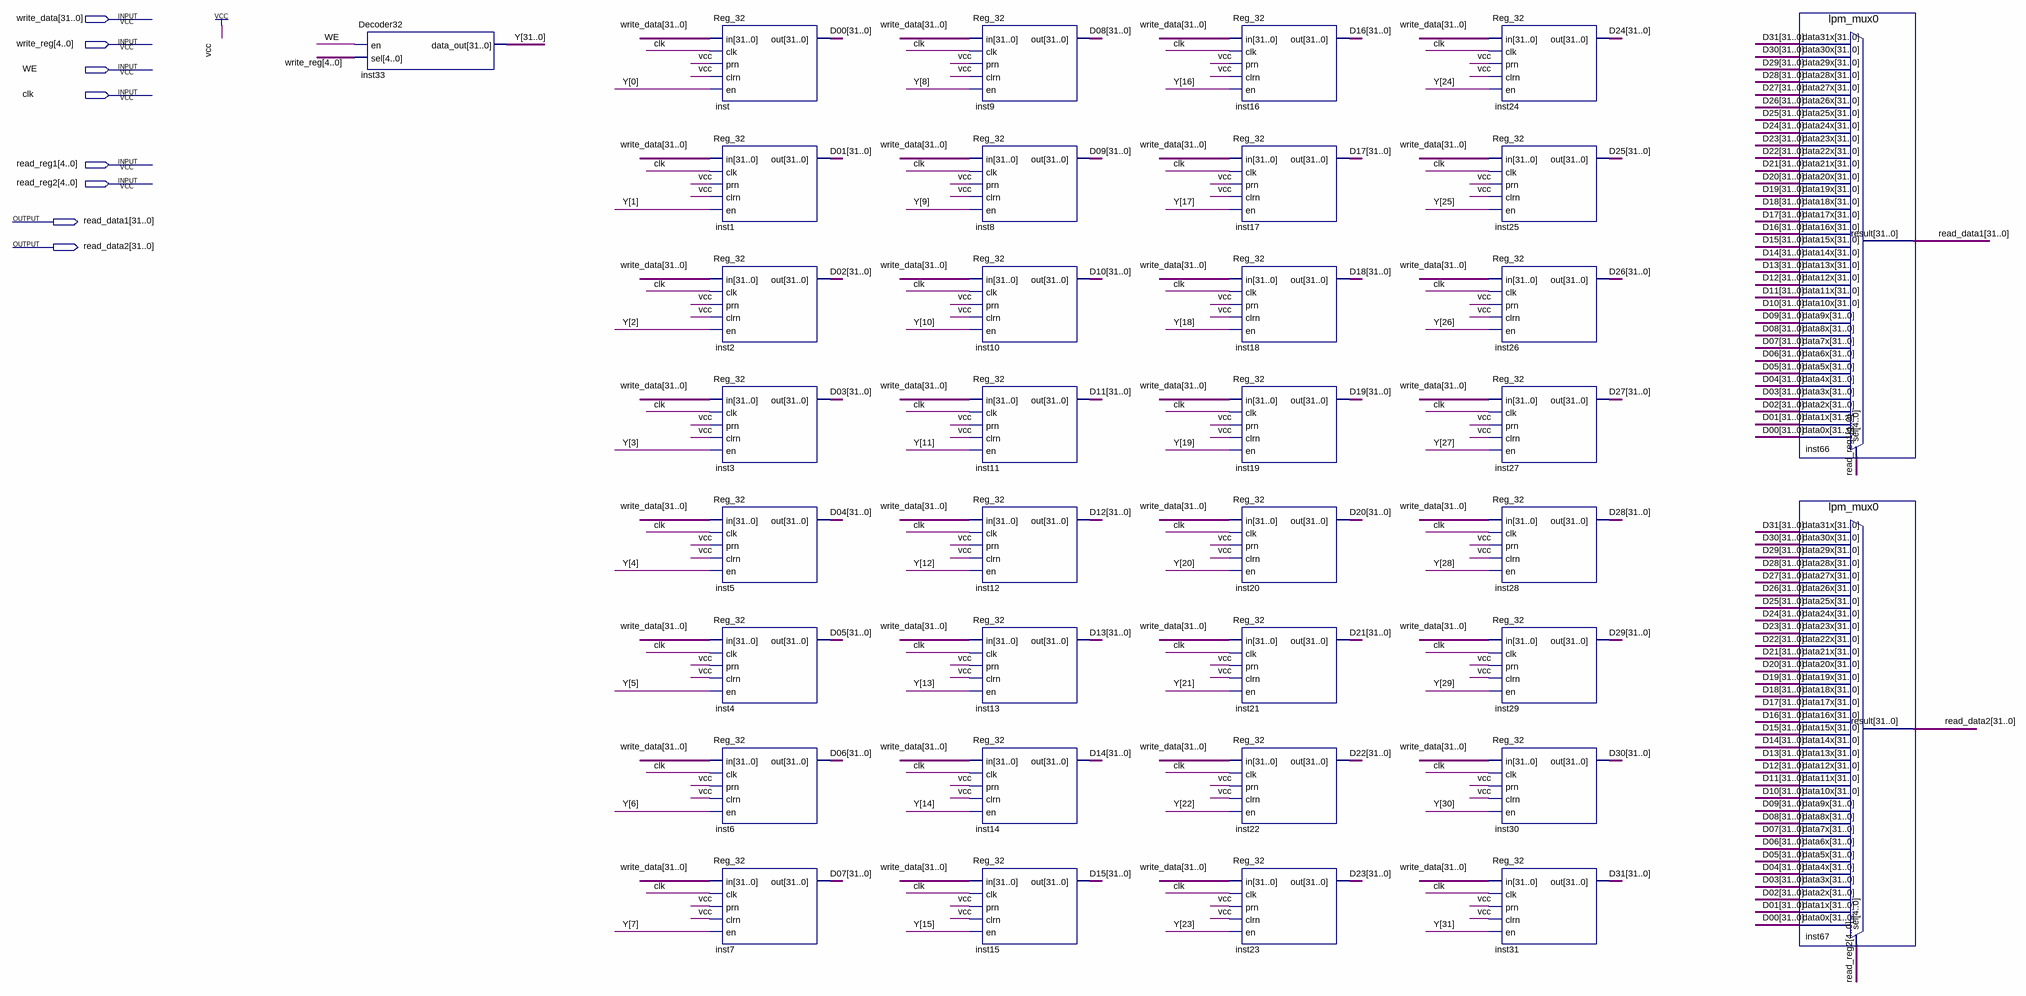
[diagram p0: schematic sheet]
// Quartus schematic Reg_Group_32.bdf as structural Verilog: 35 symbols, 8 pins
module Reg_Group_32 (
  input  [31:0] write_data,
  input  [4:0] write_reg,
  input  WE,
  input  clk,
  input  [4:0] read_reg1,
  input  [4:0] read_reg2,
  output [31:0] read_data1,
  output [31:0] read_data2
);

  wire [31:0] D00, D01, D02, D03, D04, D05, D06, D07, D08, D09, D10, D11, D12, D13, D14, D15, D16, D17, D18,
       D19, D20, D21, D22, D23, D24, D25, D26, D27, D28, D29, D30, D31, Y;

  Decoder32 inst33 (.en(WE), .sel(write_reg), .data_out(Y));
  Reg_32 inst (.in(write_data), .clk(clk), .prn(1'b1), .clrn(1'b1), .en(Y[0]), .out(D00));
  Reg_32 inst1 (.in(write_data), .clk(clk), .prn(1'b1), .clrn(1'b1), .en(Y[1]), .out(D01));
  Reg_32 inst2 (.in(write_data), .clk(clk), .prn(1'b1), .clrn(1'b1), .en(Y[2]), .out(D02));
  Reg_32 inst3 (.in(write_data), .clk(clk), .prn(1'b1), .clrn(1'b1), .en(Y[3]), .out(D03));
  Reg_32 inst5 (.in(write_data), .clk(clk), .prn(1'b1), .clrn(1'b1), .en(Y[4]), .out(D04));
  Reg_32 inst4 (.in(write_data), .clk(clk), .prn(1'b1), .clrn(1'b1), .en(Y[5]), .out(D05));
  Reg_32 inst6 (.in(write_data), .clk(clk), .prn(1'b1), .clrn(1'b1), .en(Y[6]), .out(D06));
  Reg_32 inst7 (.in(write_data), .clk(clk), .prn(1'b1), .clrn(1'b1), .en(Y[7]), .out(D07));
  Reg_32 inst9 (.in(write_data), .clk(clk), .prn(1'b1), .clrn(1'b1), .en(Y[8]), .out(D08));
  Reg_32 inst8 (.in(write_data), .clk(clk), .prn(1'b1), .clrn(1'b1), .en(Y[9]), .out(D09));
  Reg_32 inst10 (.in(write_data), .clk(clk), .prn(1'b1), .clrn(1'b1), .en(Y[10]), .out(D10));
  Reg_32 inst11 (.in(write_data), .clk(clk), .prn(1'b1), .clrn(1'b1), .en(Y[11]), .out(D11));
  Reg_32 inst12 (.in(write_data), .clk(clk), .prn(1'b1), .clrn(1'b1), .en(Y[12]), .out(D12));
  Reg_32 inst13 (.in(write_data), .clk(clk), .prn(1'b1), .clrn(1'b1), .en(Y[13]), .out(D13));
  Reg_32 inst14 (.in(write_data), .clk(clk), .prn(1'b1), .clrn(1'b1), .en(Y[14]), .out(D14));
  Reg_32 inst15 (.in(write_data), .clk(clk), .prn(1'b1), .clrn(1'b1), .en(Y[15]), .out(D15));
  Reg_32 inst16 (.in(write_data), .clk(clk), .prn(1'b1), .clrn(1'b1), .en(Y[16]), .out(D16));
  Reg_32 inst17 (.in(write_data), .clk(clk), .prn(1'b1), .clrn(1'b1), .en(Y[17]), .out(D17));
  Reg_32 inst18 (.in(write_data), .clk(clk), .prn(1'b1), .clrn(1'b1), .en(Y[18]), .out(D18));
  Reg_32 inst19 (.in(write_data), .clk(clk), .prn(1'b1), .clrn(1'b1), .en(Y[19]), .out(D19));
  Reg_32 inst20 (.in(write_data), .clk(clk), .prn(1'b1), .clrn(1'b1), .en(Y[20]), .out(D20));
  Reg_32 inst21 (.in(write_data), .clk(clk), .prn(1'b1), .clrn(1'b1), .en(Y[21]), .out(D21));
  Reg_32 inst22 (.in(write_data), .clk(clk), .prn(1'b1), .clrn(1'b1), .en(Y[22]), .out(D22));
  Reg_32 inst23 (.in(write_data), .clk(clk), .prn(1'b1), .clrn(1'b1), .en(Y[23]), .out(D23));
  Reg_32 inst24 (.in(write_data), .clk(clk), .prn(1'b1), .clrn(1'b1), .en(Y[24]), .out(D24));
  Reg_32 inst25 (.in(write_data), .clk(clk), .prn(1'b1), .clrn(1'b1), .en(Y[25]), .out(D25));
  Reg_32 inst26 (.in(write_data), .clk(clk), .prn(1'b1), .clrn(1'b1), .en(Y[26]), .out(D26));
  Reg_32 inst27 (.in(write_data), .clk(clk), .prn(1'b1), .clrn(1'b1), .en(Y[27]), .out(D27));
  Reg_32 inst28 (.in(write_data), .clk(clk), .prn(1'b1), .clrn(1'b1), .en(Y[28]), .out(D28));
  Reg_32 inst29 (.in(write_data), .clk(clk), .prn(1'b1), .clrn(1'b1), .en(Y[29]), .out(D29));
  Reg_32 inst30 (.in(write_data), .clk(clk), .prn(1'b1), .clrn(1'b1), .en(Y[30]), .out(D30));
  Reg_32 inst31 (.in(write_data), .clk(clk), .prn(1'b1), .clrn(1'b1), .en(Y[31]), .out(D31));
  lpm_mux0 inst66 (
    .data31x(D31), .data30x(D30), .data29x(D29), .data28x(D28), .data27x(D27), .data26x(D26), .data25x(D25),
    .data24x(D24), .data23x(D23), .data22x(D22), .data21x(D21), .data20x(D20), .data19x(D19), .data18x(D18),
    .data17x(D17), .data16x(D16), .data15x(D15), .data14x(D14), .data13x(D13), .data12x(D12), .data11x(D11),
    .data10x(D10), .data9x(D09), .data8x(D08), .data7x(D07), .data6x(D06), .data5x(D05), .data4x(D04),
    .data3x(D03), .data2x(D02), .data1x(D01), .data0x(D00), .sel(read_reg1), .result(read_data1));
  lpm_mux0 inst67 (
    .data31x(D31), .data30x(D30), .data29x(D29), .data28x(D28), .data27x(D27), .data26x(D26), .data25x(D25),
    .data24x(D24), .data23x(D23), .data22x(D22), .data21x(D21), .data20x(D20), .data19x(D19), .data18x(D18),
    .data17x(D17), .data16x(D16), .data15x(D15), .data14x(D14), .data13x(D13), .data12x(D12), .data11x(D11),
    .data10x(D10), .data9x(D09), .data8x(D08), .data7x(D07), .data6x(D06), .data5x(D05), .data4x(D04),
    .data3x(D03), .data2x(D02), .data1x(D01), .data0x(D00), .sel(read_reg2), .result(read_data2));
endmodule
